# Altium schematic sheet PowerBoost_Adafruit_based.SchDoc
size A4; PageSetup: Record=PageOptions|CenterHorizontal=True|CenterVertical=True|PrintScale=0.97|XCorrection=1.00|YCorrection=1.00|PrintKind=0|BorderSize=5000000|LeftOffset=0|BottomOffset=0|Orientation=2|PaperLength=1000|PaperWidth=1000|Scale=100|PaperSource=7|PrintQuality=-3|MediaType=1|DitherType=10|PrintScaleMode=1|PaperKind=A4|PaperIndex=9
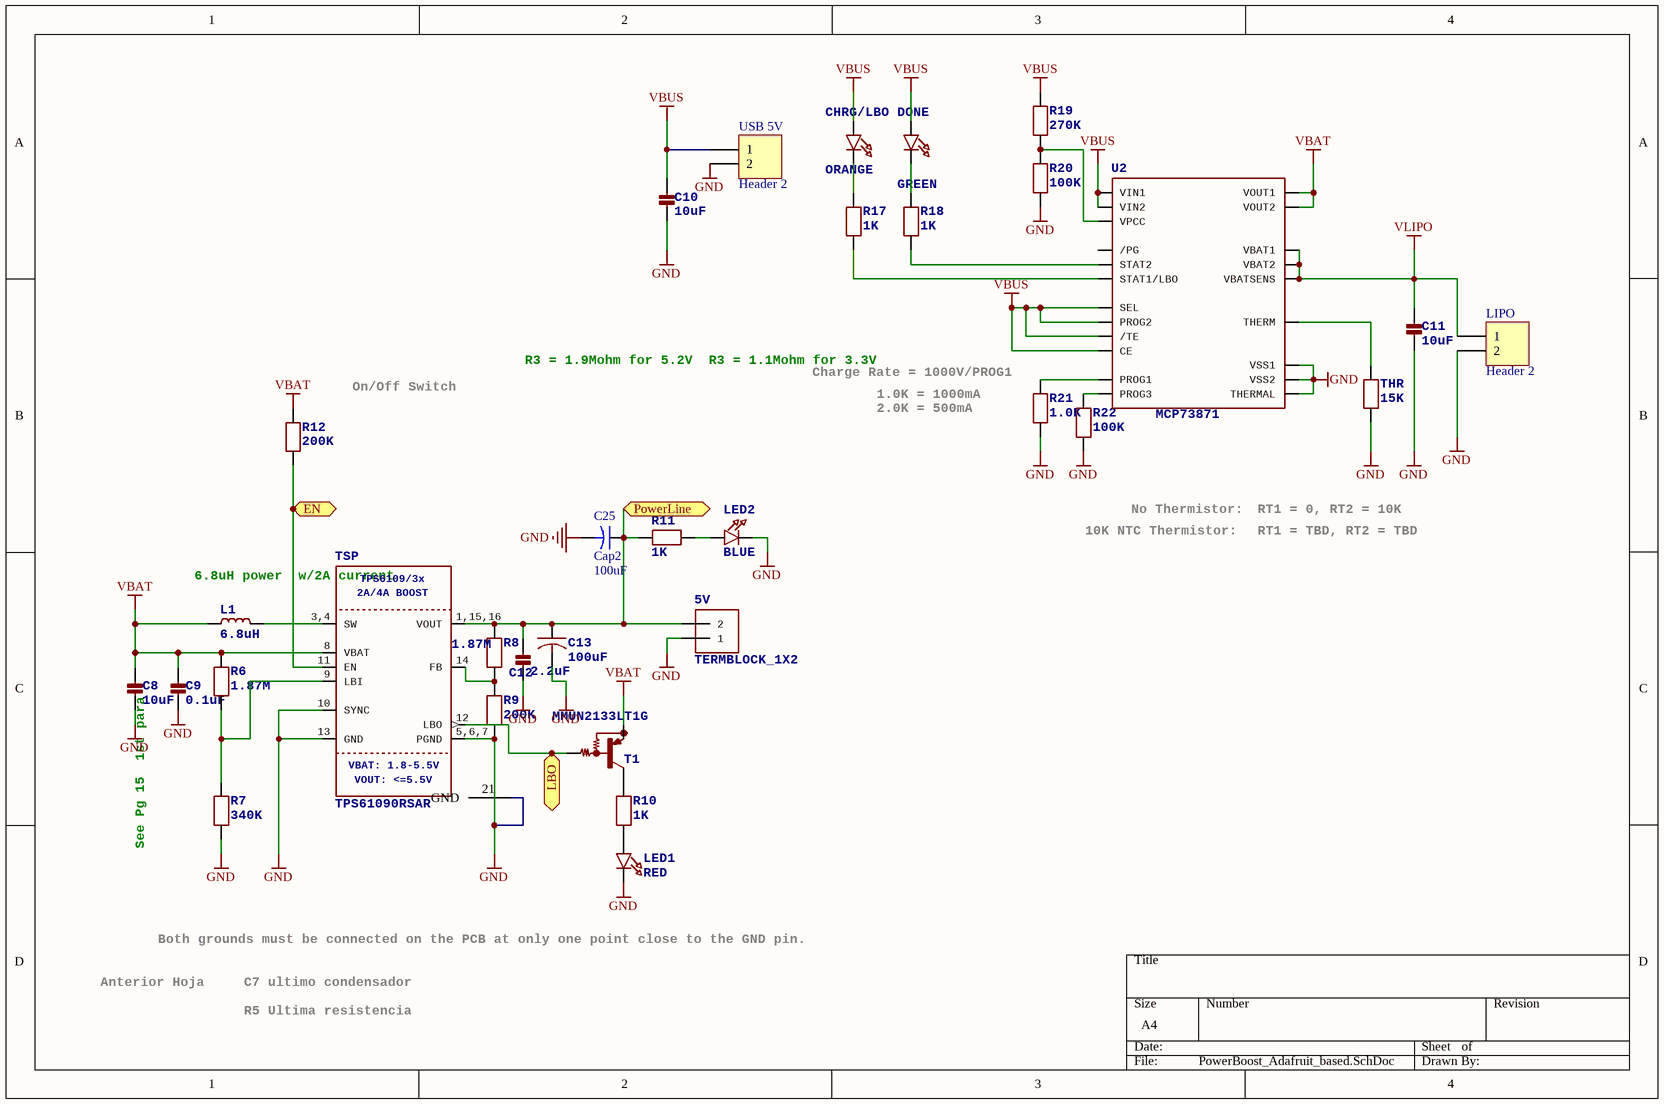
[diagram p0: PowerBoost_Adafruit_based.SchDoc]

## Parts
5V  TERMBLOCK_1X2  [TERMBLOCK_1X2-3.5MM]
C8  10uF  [1608[0603]]
C9  0.1uF  [1608[0603]]
C10  10uF  [RES-1206in]
C11  10uF  [RES-1206in]
C12  2.2uF  [RES-0805]
C13  100uF  [RES-1206in]
C25  Cap2  value 100uF  [RES-1206in]
CHRG/LBO  ORANGE  [RES-0805]
DONE  GREEN  [RES-0805]
L1  6.8uH  [INDUCTOR_5X5MM_TDK_VLC5045]
LED1  RED  [RES-0805]
LED2  BLUE  [RES-0805]
LIPO  Header 2  [HDR1X2]
R6  1.87M  [RES-1206in]
R7  340K  [RES-1206in]
R8  1.87M  [RES-1206in]
R9  200K  [RES-1206in]
R10  1K  [RES-1206in]
R11  1K  [RES-1206in]
R12  200K  [RES-1206in]
R17  1K  [RES-1206in]
R18  1K  [RES-1206in]
R19  270K  [RES-1206in]
R20  100K  [RES-1206in]
R21  1.0K  [RES-1206in]
R22  100K  [RES-1206in]
T1  MMUN2133LT1G  [MMUN2133LT1G]
THR  15K  [Res-0603]
TSP  TPS61090RSAR  2A/4ABOOST: 2A/4A BOOST  VBAT:1.8-5.5V: VBAT: 1.8-5.5V  VOUT:<=5.5V: VOUT: <=5.5V  [QFN65P400X400X100-17N]
U2  MCP73871  [QFN50P400X400X100-21N]
USB_5V  Header 2  [HDR1X2]

## Ports
EN, LBO, PowerLine

## Nets
GND: 5V.1 C8.2 C9.2 C10.2 C11.2 C12.2 C13.2 C25.2 LED1.2(C) LED2.2 LIPO.2 R7.1 R9.1 R20.2 R21.1 R22.1 THR.1 TSP.5,6,7(PGND) TSP.10(SYNC) TSP.13(GND) TSP.21(GND) U2.10(VSS1) U2.11(VSS2) U2.21(THERMAL) USB_5V.2
VBAT: C8.1 C9.1 L1.1 R6.2 R12.1 T1.2(E) TSP.8(VBAT) U2.1(VOUT1) U2.20(VOUT2)
VBUS: C10.1 CHRG/LBO.1(A) DONE.1(A) R19.2 U2.3(SEL) U2.4(PROG2) U2.9(/TE) U2.17(CE) U2.18(VIN1) U2.19(VIN2) USB_5V.1
VLIPO: C11.1 LIPO.1 U2.14(VBAT1) U2.15(VBAT2) U2.16(VBATSENS)
EN: R12.2 TSP.11(EN) ; port EN
LBO: T1.1(B) TSP.12(LBO) ; port LBO
PowerLine: 5V.2 C12.1 C13.1 C25.1 R8.2 R11.1 TSP.1,15,16(VOUT) ; port PowerLine
NetCHRG/LBO_2: CHRG/LBO.2(C) R17.2
NetDONE_2: DONE.2(C) R18.2
NetL1_2: L1.2 TSP.3,4(SW)
NetLED1_1: LED1.1(A) R10.1
NetLED2_1: LED2.1(A) R11.2
NetR6_1: R6.1 R7.2 TSP.9(LBI)
NetR8_1: R8.1 R9.2 TSP.14(FB)
NetR10_2: R10.2 T1.3(C)
NetR17_1: R17.1 U2.8(STAT1/LBO)
NetR18_1: R18.1 U2.7(STAT2)
NetR19_1: R19.1 R20.1 U2.2(VPCC)
NetR21_2: R21.2 U2.13(PROG1)
NetR22_2: R22.2 U2.12(PROG3)
NetTHR_2: THR.2 U2.5(THERM)

Not connected (* = marked no-connect by the designer): U2 6(/PG)

## Notes on the sheet
- On/Off Switch
- R3 = 1.9Mohm for 5.2V
  R3 = 1.1Mohm for 3.3V
- Charge Rate = 1000V/PROG1
- 1.0K = 1000mA
- 2.0K = 500mA
- 10K NTC Thermistor:
- No Thermistor:
- RT1 = 0, RT2 = 10K
- RT1 = TBD, RT2 = TBD
- 6.8uH power
  w/2A current
- See Pg 15
  1st para
- Both grounds must be connected on the PCB at only one point close to the GND pin.
- Anterior Hoja
- C7 ultimo condensador
- R5 Ultima resistencia

## Library data of the parts
5V = TERMBLOCK_1X2: 3.5mm Terminal block    http://www.ladyada.net/library/pcb/eaglelibrary.html; COMPANY: ADAFRUIT INDUSTRIES; DRAWN: KTOWN; REV: A
C8 C10-C12 = CAP_CERAMIC0805-NOOUTLINE: Ceramic Capacitors   For new designs, use the packages preceded by an '_' character since they are more reliable:   The following footprints should be used on most boards: _0402 - Standard footprint for regular board layouts  _0603 - Standard footprint for regular board layouts  _0805 - Standard footprint for regular board layouts  _1206 - Standard footprint for regular board layouts       For extremely tight-pitch boards where space is at a premium, the following 'micro-pitch' footprints can be used (smaller pads, no silkscreen outline, etc.): _0402MP - Micro-pitch footprint for very dense/compact boards  _0603MP - Micro-pitch footprint for very dense/compact boards  _0805MP - Micro-pitch footprint for very dense/compact boards  _1206MP - Micro-pitch footprint for very dense/compact boards; COMPANY: ADAFRUIT INDUSTRIES; DRAWN: KTOWN; REV: A
C9 = CAP_CERAMIC0805_10MGAP: Ceramic Capacitors   For new designs, use the packages preceded by an '_' character since they are more reliable:   The following footprints should be used on most boards: _0402 - Standard footprint for regular board layouts  _0603 - Standard footprint for regular board layouts  _0805 - Standard footprint for regular board layouts  _1206 - Standard footprint for regular board layouts       For extremely tight-pitch boards where space is at a premium, the following 'micro-pitch' footprints can be used (smaller pads, no silkscreen outline, etc.): _0402MP - Micro-pitch footprint for very dense/compact boards  _0603MP - Micro-pitch footprint for very dense/compact boards  _0805MP - Micro-pitch footprint for very dense/compact boards  _1206MP - Micro-pitch footprint for very dense/compact boards; COMPANY: ADAFRUIT INDUSTRIES; DRAWN: KTOWN; REV: A
C13 = C-USC1210: CAPACITOR, American symbol; COMPANY: ADAFRUIT INDUSTRIES; DRAWN: KTOWN; REV: A
C25 = Cap2: Capacitor; Published: 23-Sep-2002; PackageReference: CAPR5-4X5; Publisher: Altium Limited; PackageDescription: Capacitor; 2 Leads
CHRG/LBO DONE LED1 LED2 = LED0805_NOOUTLINE: LED0603 - 0603 Surface Mount Package    2mA: Green LED - Low Power (3.9mcd, 2ma, 1.7Vf) - Digikey: 475-2709-2-ND  Orange LED - Low Power (9.8mcd, 2ma, 1.8Vf) - Digikey: 475-1194-2-ND  Red LED - Low Power (5mcd, 2ma, 1.8Vf) - Digikey: 475-1195-2-ND  Yellow LED - Low Power (7mcd, 2ma, 1.8Vf) - Digikey: 475-1196-2-ND       5mA: Blue LED - Low Power (17mcd, 5ma, 2.9Vf) - Digikey: LNJ937W8CRACT-ND    0805 - 0805 Surface Mount Package    2mA: Red LED (8.8mcd, 2mA, 1.8Vf, Clear) - Low Power [Digikey: 475-2510-1-ND]  Green LED (5mcd, 2mA, 1.8Vf, Clear) - Low Power [Digikey: 475-2730-1-ND]  Yellow LED (11.3mcd, 2mA, 1.8Vf, Clear) - Low Power [Digikey: 475-2555-1-ND]       20mA: Red LED (104mcd, 20mA, Diffused) - LS R976 [Digikey: 475-1278-6-ND]  Red LED (12mcd, 20mA, 2.0Vf, Clear) - APT2012EC [Digikey: 754-1128-1-ND]  Green LED (15mcd, 20mA, 2.2Vf, Clear) - APT2012GC [Digikey: 754-1131-1-ND]  Orange LED (160mcd, 20mA, 2.1Vf, Clear) - APT2012SECK [Digikey: 754-1130-1-ND]     1206 - 1206 Surface Mount Package  Green LED (26mcd, 20mA, Diffused) - LG N971  [Digikey: 475-1407-6-ND]  Red LED (15mcd, 20mA, Diffused) - LH N974 [Digikey: 475-1416-6-ND]     Cree - Cree High-Power Surface Mount LEDs  XPEBWT-L1-0000-00D50 - White 111lm 350mA 2.9Vf 6200K 110°  XTEAWT-00-0000-00000LEE3 - White 114lm 350mA 2.85Vf 5000K 115°     Everlight - Everlight 45-21 Series Surface Mount LEDs  45-21/QK2C-B2832AC2CB2/2T - Warm White 2000mcd 20mA 3.25Vf 3050K 120°  45-21/LK2C-B38452C4CB2/2T - Nuetral White 2000mcd 20mA 3.25Vf 4150K 120°  45-21/LK2C-B50634C6CB2/2T - Cold White 2200mcd 20mA 3.25Vf 5650K 120°     PLCC2 Reverse Mount LS T77K-J1L2-1-0-2-R18-Z - Red 11.25mcd 2mA 1.8Vf 630nm 120°  LO T77K-L1M2-24-Z - Orange 19.6mcd 2mA 1.8Vf 606nm 120°  LY T77K-K2M1-26-Z - Yellow 15.7mcd 2mA 1.8Vf 587nm 120°; COMPANY: ADAFRUIT INDUSTRIES; DRAWN: KTOWN; REV: A
L1 = INDUCTORTDK_VLC5045: Inductors   0603: 10nH Ceramic Inductor - microwire antenna/RF (Digikey: 712-1434-2-ND)       0805: 560nH Ceramic Inductor - RF (Digikey: 553-1047-1-ND)  270nH Ceramic Inductor - Q = 40@250MHz, +-5%, 1 Ohm DC Resistance (Digikey: 535-10506-2-ND)       1007 (2518 Metric) SMT: 10µH 10% 250mOhm 820mA 1007 Inductor (Digikey: 587-2189-1-ND)  22µH 10% 500mOhm 580mA 1007 Inductor (Digikey: 587-2190-1-ND)  47µH 10% 950mOhm 420mA 1007 Inductor (Digikey: 587-2191-1-ND)  47µH 5% 100mOhm 1A 1008 Inductor (Digikey: 732-1816-1-ND)       5.0x5.0mm (Taiyo Yuden NR5040 Series) 6.8µH 20% 2.3A 64mOhm Inductor (Digikey: 587-2374-2-ND)       5.0x5.0mm (TDK VLC5045 Series) 4.7µH 20% 3.3A 34mOhm Inductor (Digikey: 445-6526-1-ND)  6.8µH 20% 2.7A 46mOhm Inductor (Digikey: 445-6527-1-ND)       6.0x6.0mm (TDK VLC6045 Series) 4.7µH 20% 3.8A 27mOhm Inductor (Digikey: 445-6538-2-ND)  6.8µH 20% 3A 41mOhm Inductor (Digikey: 445-6540-1-ND)  6.2µH 30% 2.2A 45mOhm Inductor (Digikey: SRR5028-6R2YCT-ND) - Not TDK VLC6045 but footprint should match       6.0x6.0mm (TDK SLF6045 Series) 6.8uH 30% 2A 33mOhm Inductor (Digikey: 445-4572-1-ND, Mouser: 810-SLF645T6R8N2R0PF)       6.0x6.0mm (Sumida CDRH5D28 Series) 6.2uH 30% 1.8A 45mOhm Inductor (Digikey: 308-1542-1-ND)       Taiyo Yuden NR3015T2R2M - 2.2uH 20% 1.5A (Digikey: 587-1648-2-ND, Mouser: 963-NR3015T2R2M) - Used with TI TPS62172   CoilCraft RFID Transponder Coil - MA5532-AE (For use with AS3935 Lightning Sensor)   Vishay IHLP  1.0uH Molded Inductor - 24mOhm DCR, 5A, +/-20%, -55°C-125°C (Digikey: 541-1319-1-ND); COMPANY: ADAFRUIT INDUSTRIES; DRAWN: KTOWN; REV: A
LIPO USB_5V = Header 2: Header, 2-Pin; LatestRevisionDate: 17-Jul-2002; LatestRevisionNote: Re-released for DXP Platform.; Publisher: Altium Limited
R6 R7 = RESISTOR_0805MP: Resistors   For new designs, use the packages preceded by an '_' character since they are more reliable:   The following footprints should be used on most boards: _0402 - Standard footprint for regular board layouts  _0603 - Standard footprint for regular board layouts  _0805 - Standard footprint for regular board layouts  _1206 - Standard footprint for regular board layouts       For extremely tight-pitch boards where space is at a premium, the following 'micro-pitch' footprints can be used (smaller pads, no silkscreen outline, etc.): _0402MP - Micro-pitch footprint for very dense/compact boards  _0603MP - Micro-pitch footprint for very dense/compact boards  _0805MP - Micro-pitch footprint for very dense/compact boards  _1206MP - Micro-pitch footprint for very dense/compact boards; COMPANY: ADAFRUIT INDUSTRIES; DRAWN: KTOWN; REV: A
R8-R12 R17-R22 THR = RESISTOR0805_NOOUTLINE: Resistors   For new designs, use the packages preceded by an '_' character since they are more reliable:   The following footprints should be used on most boards: _0402 - Standard footprint for regular board layouts  _0603 - Standard footprint for regular board layouts  _0805 - Standard footprint for regular board layouts  _1206 - Standard footprint for regular board layouts       For extremely tight-pitch boards where space is at a premium, the following 'micro-pitch' footprints can be used (smaller pads, no silkscreen outline, etc.): _0402MP - Micro-pitch footprint for very dense/compact boards  _0603MP - Micro-pitch footprint for very dense/compact boards  _0805MP - Micro-pitch footprint for very dense/compact boards  _1206MP - Micro-pitch footprint for very dense/compact boards; COMPANY: ADAFRUIT INDUSTRIES; DRAWN: KTOWN; REV: A
T1 = *-PNP_DRIVER-SC59-BEC: PNP Bias Resistor Transistor
TSP = VREG_TPS6103X: TPS6103x 4A Boost - 1.8-5.5V Input, Adjustable Output to 5.5V; COMPANY: ADAFRUIT INDUSTRIES; DRAWN: KTOWN; REV: A; TPS6109/3x: TPS6109/3x
U2 = MCP73871: MCP73871 Lithium Polymer Battery Charger   Digikey: MCP73871-2CCI/ML-ND; COMPANY: ADAFRUIT INDUSTRIES; DRAWN: KTOWN; REV: A